# EAGLE design PNP (EAGLE 6.1)
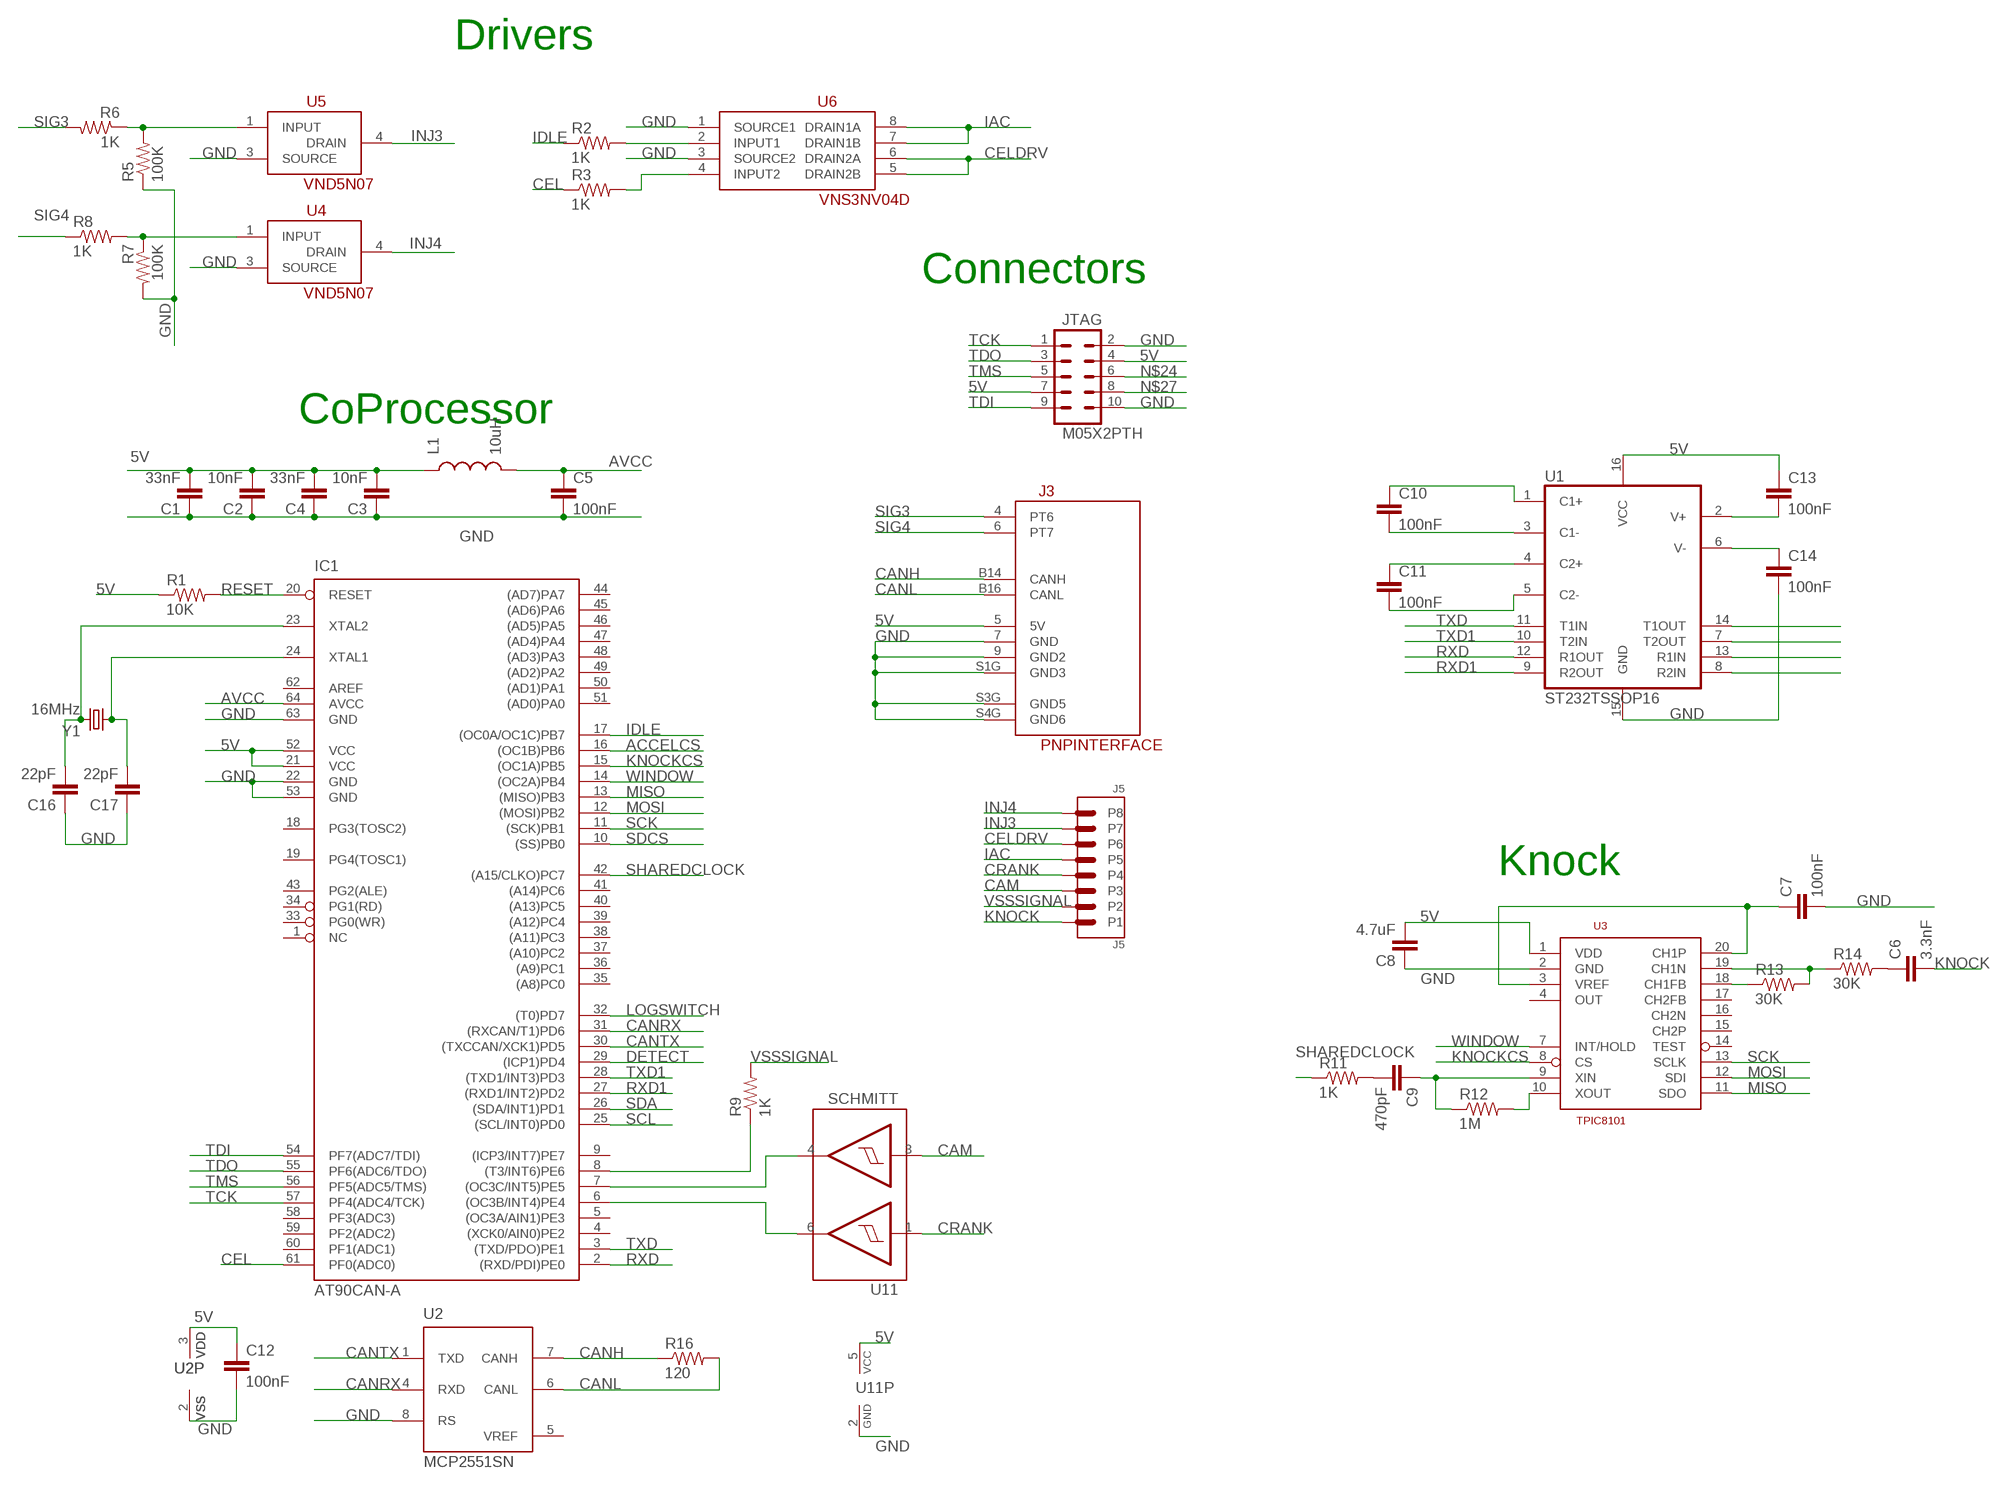
[diagram p0: schematic, sheet 1]

## Parts
C1  33nF  CAP0805  [0805]
C2  10nF  CAP0805  [0805]
C3  10nF  CAP0805  [0805]
C4  33nF  CAP0805  [0805]
C5  100nF  CAP0805  [0805]
C6  3.3nF  CAP0805  [0805]
C7  100nF  CAP0805  [0805]
C8  4.7uF  CAP0805  [0805]
C9  470pF  CAP0805  [0805]
C10  100nF  CAP0805  [0805]
C11  100nF  CAP0805  [0805]
C12  100nF  CAP0805  [0805]
C13  100nF  CAP0805  [0805]
C14  100nF  CAP0805  [0805]
C16  22pF  CAP0805  [0805]
C17  22pF  CAP0805  [0805]
IC1  AT90CAN-A  [TQFP64]
J3  PNPINTERFACE  [PNPBOARD]
J5  J5  TERMINAL8  [TERMINAL8]
JTAG  M05X2PTH  [AVR_ICSP]
L1  10uH  INDUCTOR1210  [1210]
R1  10K  RESISTOR0805-RES  [0805]
R2  1K  RESISTOR0805-RES  [0805]
R3  1K  RESISTOR0805-RES  [0805]
R5  100K  RESISTOR0805-RES  [0805]
R6  1K  RESISTOR0805-RES  [0805]
R7  100K  RESISTOR0805-RES  [0805]
R8  1K  RESISTOR0805-RES  [0805]
R9  1K  RESISTOR0805-RES  [0805]
R11  1K  RESISTOR0805-RES  [0805]
R12  1M  RESISTOR0805-RES  [0805]
R13  30K  RESISTOR0805-RES  [0805]
R14  30K  RESISTOR0805-RES  [0805]
R16  120  RESISTOR0805-RES  [0805]
U1  ST232TSSOP16  [TSSOP16]
U2  MCP2551SN  [SO8]
U3  TPIC8101  [SO-20DW]
U4  VND5N07  [DPAK]
U5  VND5N07  [DPAK]
U6  VNS3NV04D  [SO8]
U11  SCHMITT  SCHMITTTSOP  [TSOP6]
Y1  16MHz  CRYSTAL  [SM2-CRYSTAL-7ASERIES]

## Nets
5V: C1.2 C2.2 C3.2 C4.2 C8.2 C12.1 C13.1 IC1.21(VCC) IC1.52(VCC) J3.5(5V) JTAG.4 JTAG.7 L1.1 R1.1 U1.16(VCC) U2.3(VDD) U3.1(VDD) U11.5(VCC)
ACCELCS: IC1.16((OC1B)PB6)
AVCC: C5.1 IC1.64(AVCC) L1.2
CAM: J5.P3 U11.3(I2)
CANH: J3.B14(CANH) R16.1 U2.7(CANH)
CANL: J3.B16(CANL) R16.2 U2.6(CANL)
CANRX: IC1.31((RXCAN/T1)PD6) U2.4(RXD)
CANTX: IC1.30((TXCCAN/XCK1)PD5) U2.1(TXD)
CEL: IC1.61(PF0(ADC0)) R3.1
CELDRV: J5.P6 U6.5(DRAIN2B) U6.6(DRAIN2A)
CRANK: J5.P4 U11.1(I1)
DETECT: IC1.29((ICP1)PD4)
GND: C1.1 C2.1 C3.1 C4.1 C5.2 C7.2 C8.1 C12.2 C14.2 C16.1 C17.1 IC1.22(GND) IC1.53(GND) IC1.63(GND) J3.7(GND) J3.9(GND2) J3.S1G(GND3) J3.S3G(GND5) J3.S4G(GND6) JTAG.2 JTAG.10 R5.1 R7.2 U1.15(GND) U2.2(VSS) U2.8(RS) U3.2(GND) U4.3(SOURCE) U5.3(SOURCE) U6.1(SOURCE1) U6.3(SOURCE2) U11.2(GND)
IAC: J5.P5 U6.7(DRAIN1B) U6.8(DRAIN1A)
IDLE: IC1.17((OC0A/OC1C)PB7) R2.1
INJ3: J5.P7 U5.4(DRAIN)
INJ4: J5.P8 U4.4(DRAIN)
KNOCK: C6.2 J5.P1
KNOCKCS: IC1.15((OC1A)PB5) U3.8(CS)
LOGSWITCH: IC1.32((T0)PD7)
MISO: IC1.13((MISO)PB3) U3.11(SDO)
MOSI: IC1.12((MOSI)PB2) U3.12(SDI)
N$1: C6.1 R14.2
N$2: R5.2 R6.1 U5.1(INPUT)
N$3: IC1.7((OC3C/INT5)PE5) U11.4(O2)
N$4: IC1.6((OC3B/INT4)PE4) U11.6(O1)
N$5: R2.2 U6.2(INPUT1)
N$6: C9.2 R11.2
N$7: R3.2 U6.4(INPUT2)
N$8: R7.1 R8.2 U4.1(INPUT)
N$9: C10.1 U1.1(C1+)
N$10: C10.2 U1.3(C1-)
N$11: IC1.8((T3/INT6)PE6) R9.1
N$12: C9.1 R12.1 U3.9(XIN)
N$13: C11.1 U1.4(C2+)
N$14: R12.2 U3.10(XOUT)
N$15: C16.2 IC1.23(XTAL2) Y1.P$2
N$16: C17.2 IC1.24(XTAL1) Y1.P$1
N$17: C11.2 U1.5(C2-)
N$18: C7.1 U3.3(VREF) U3.20(CH1P)
N$19: U1.7(T2OUT)
N$20: C13.2 U1.2(V+)
N$21: C14.1 U1.6(V-)
N$22: R13.2 R14.1 U3.19(CH1N)
N$23: R13.1 U3.18(CH1FB)
N$24: JTAG.6
N$27: JTAG.8
N$30: U1.14(T1OUT)
N$31: U1.13(R1IN)
N$32: U1.8(R2IN)
RESET: IC1.20(RESET) R1.2
RXD: IC1.2((RXD/PDI)PE0) U1.12(R1OUT)
RXD1: IC1.27((RXD1/INT2)PD2) U1.9(R2OUT)
SCK: IC1.11((SCK)PB1) U3.13(SCLK)
SCL: IC1.25((SCL/INT0)PD0)
SDA: IC1.26((SDA/INT1)PD1)
SDCS: IC1.10((SS)PB0)
SHAREDCLOCK: IC1.42((A15/CLKO)PC7) R11.1
SIG3: J3.4(PT6) R6.2
SIG4: J3.6(PT7) R8.1
TCK: IC1.57(PF4(ADC4/TCK)) JTAG.1
TDI: IC1.54(PF7(ADC7/TDI)) JTAG.9
TDO: IC1.55(PF6(ADC6/TDO)) JTAG.3
TMS: IC1.56(PF5(ADC5/TMS)) JTAG.5
TXD: IC1.3((TXD/PDO)PE1) U1.11(T1IN)
TXD1: IC1.28((TXD1/INT3)PD3) U1.10(T2IN)
VSSSIGNAL: J5.P2 R9.2
WINDOW: IC1.14((OC2A)PB4) U3.7(INT/HOLD)
Unconnected: IC1.1(NC) IC1.4((XCK0/AIN0)PE2) IC1.5((OC3A/AIN1)PE3) IC1.9((ICP3/INT7)PE7) IC1.18(PG3(TOSC2)) IC1.19(PG4(TOSC1)) IC1.33(PG0(WR)) IC1.34(PG1(RD)) IC1.35((A8)PC0) IC1.36((A9)PC1) IC1.37((A10)PC2) IC1.38((A11)PC3) IC1.39((A12)PC4) IC1.40((A13)PC5) IC1.41((A14)PC6) IC1.43(PG2(ALE)) IC1.44((AD7)PA7) IC1.45((AD6)PA6) IC1.46((AD5)PA5) IC1.47((AD4)PA4) IC1.48((AD3)PA3) IC1.49((AD2)PA2) IC1.50((AD1)PA1) IC1.51((AD0)PA0) IC1.58(PF3(ADC3)) IC1.59(PF2(ADC2)) IC1.60(PF1(ADC1)) IC1.62(AREF) U2.5(VREF) U3.4(OUT) U3.14(TEST) U3.15(CH2P) U3.16(CH2N) U3.17(CH2FB)

## Notes on the sheet
- Drivers
- Connectors
- CoProcessor
- Knock

## Library data of the parts
C1-C14 C16 C17 = PNP:CAP: Capacitor Standard 0603 ceramic capacitor, and 0.1" leaded capacitor.
IC1 = PNP:AT90CAN: MICROCONTROLLER 32 Kbytes FLASH 2 Kbytes SRAM 1 Kbytes EEPROM CAN Controller 8-channel 10 bit ADC; DIGIKEY: AT90CAN32-16AU-ND; MPN: AT90CAN32-16AU
J3 = PNP:PNPINTERFACE: One use, interface to DIYPNP1.5 jumper locations
J5 = PNP:TERMINAL8: 8 terminal pluggable
JTAG = SparkFun:M05X2: Header 5x2 Standard 10-pin dual row 0.1" header. Commonly used with AVR-ISP. Use with Spark Fun Electronics SKU: PRT-00778
L1 = PNP:INDUCTOR: Inductors Basic Inductor/Choke - 0603 and 1206. Footprints are not proven and vary greatly between part numbers.
R1-R3 R5-R9 R11-R14 R16 = PNP:RESISTOR: Resistor Basic schematic elements and footprints for 0603, 1206, and PTH resistors.
U1 = PNP:ST232: RS232 Transceiver Very common IC. This is generically called 'MAX232', but works with the 3V equivalent MAX3232 generic ICs. Field tested and mother approved. Spark Fun Electronics SKU : COM-00316 (DIP) and COM-00589 (SMD)
U2 = PNP:MCP2551: High Speed CAN tranceiver
U3 = PNP:TPIC8101: Knock Detector Processing Chip, controllable over SPI; DIGIKEY: 296-24864-1-ND; MFN: TPIC8101DWRG4
U4 U5 = PNP:VND5N07: Single Power MOSFET of the OMNIFET family, 5A; DIGIKEY: 497-2481-5-ND; MFN: VND5N07
U6 = PNP:VNS3NV04D: Dual Protected MOSFET from OMNIFET family, 3A; DIGIKEY: 497-3318-1-ND; MFN: VNS3NV04D13TR
U11 = PNP:SCHMITT; DIGIKEY: 568-4618-1-ND; MFN: 74LVC2G17GV,125
Y1 = PNP:CRYSTAL: Crystals Various standard crystals. Proven footprints. Spark Fun Electronics SKU : COM-00534

## Net classes
0 default: width 0.203 mm, drill 0.254 mm, clearance 0.254 mm

## Board
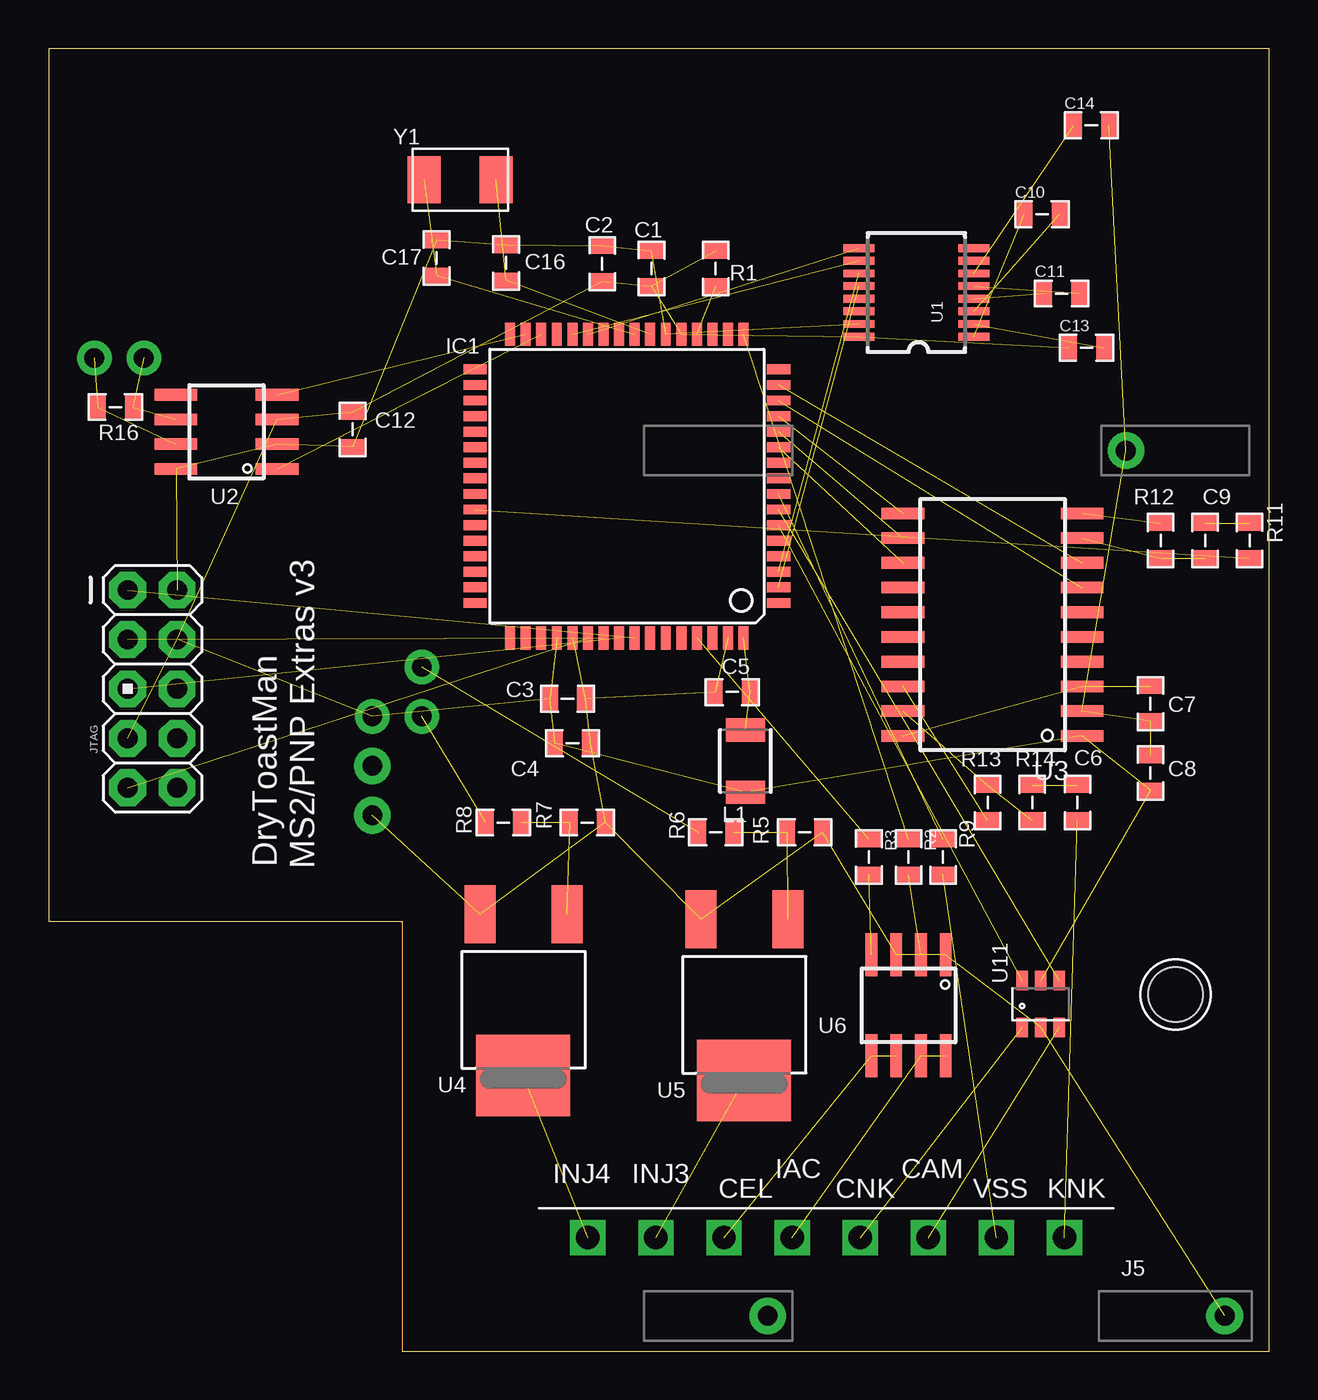
[diagram p1: board, top side]
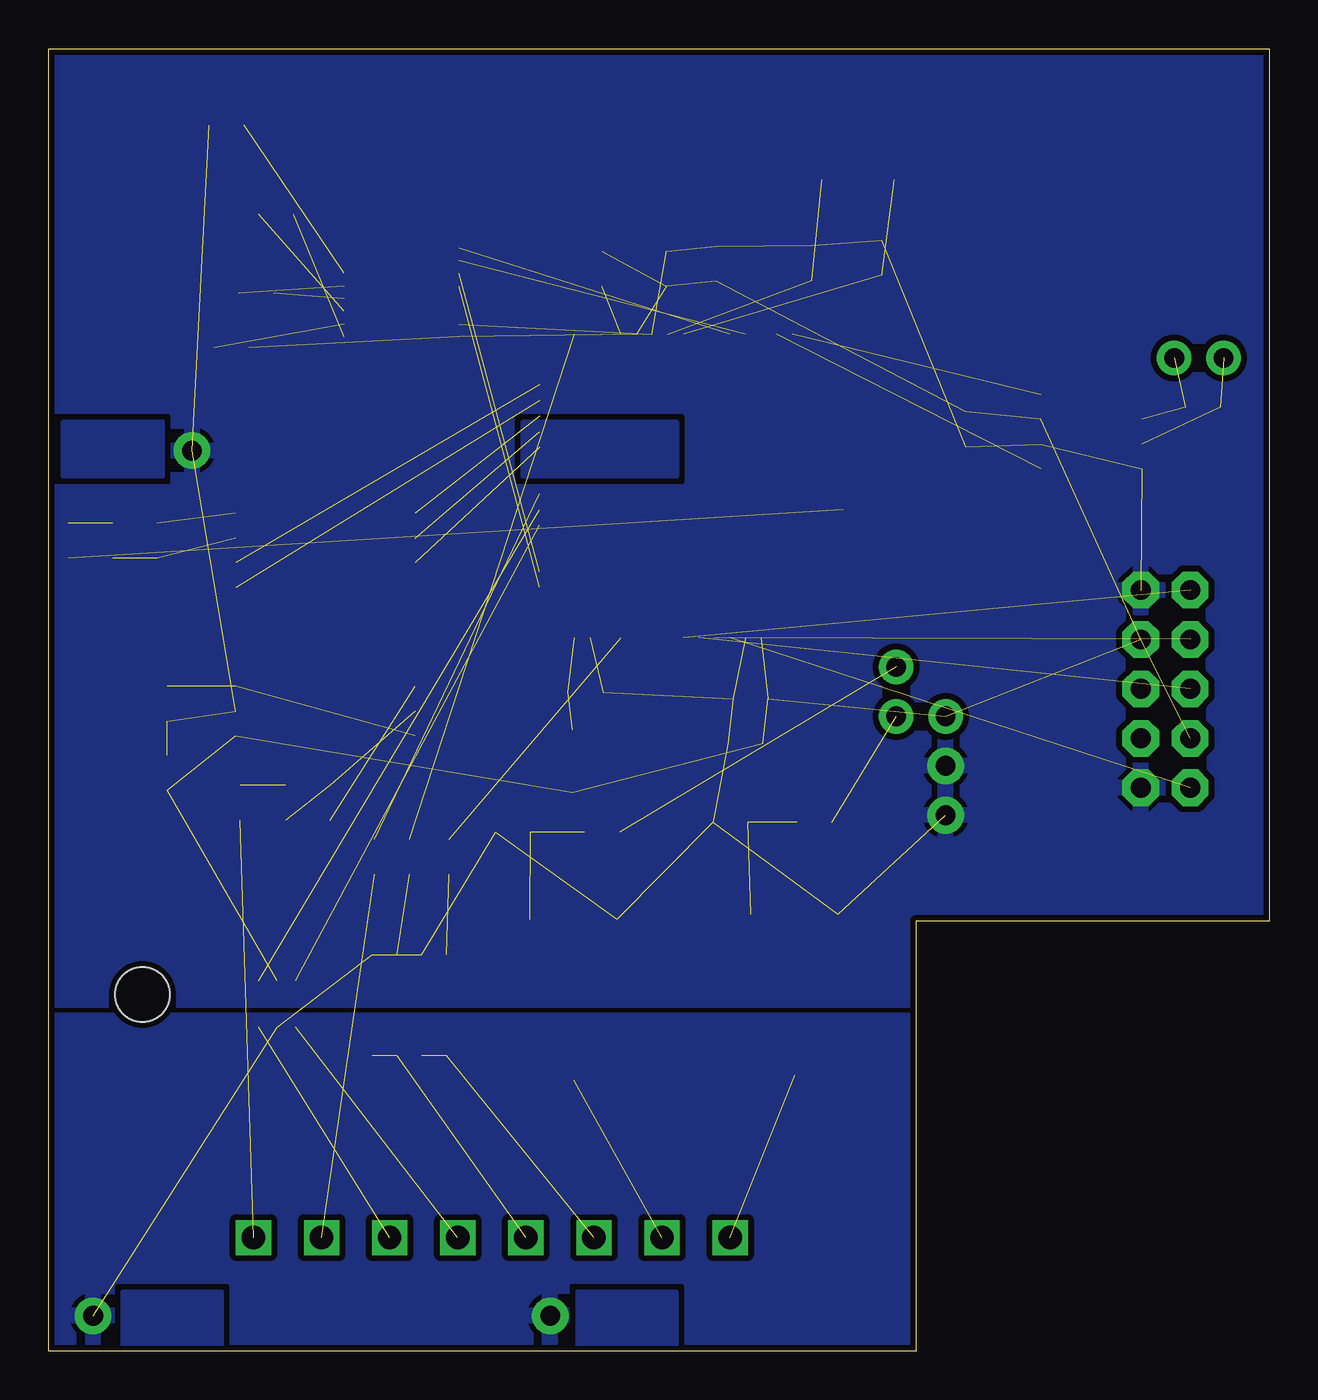
[diagram p2: board, bottom side, seen from below]

Size 62.74 x 66.93 mm. Coordinates in mm from the lower left corner, seen from the top.
Outline: 0,22.1 18.16,22.1 18.16,0 62.74,0 62.74,66.93 0,66.93 0,22.1
Copper layers (1*16): Top 0.035mm / dielectric 1.5mm / Bottom 0.035mm
Design rules: minimum track width 8mil, minimum drill 20mil, track to track 8mil, track to pad 8mil, pad to pad 8mil, via to via 8mil, smd to smd 8mil, copper to edge 10mil, drill to drill 8mil, minimum pad ring 12mil, minimum via ring 10mil, stop-mask expansion 4mil, vias tented up to drill 25mil, thermal gap 10mil

### Footprints (pad centres in the part's own frame; a part is rotated, then mirrored left to right if it is on the bottom)
0805 = smd 0.8 x 1.2: 1 -0.9,0; 2 0.9,0
TQFP64 = smd 1.194 x 0.508: 1 -7.8,6; 2 -7.8,5.2; 3 -7.8,4.4; 4 -7.8,3.6; 5 -7.8,2.8; 6 -7.8,2; 7 -7.8,1.2; 8 -7.8,0.4; 9 -7.8,-0.4; 10 -7.8,-1.2; 11 -7.8,-2; 12 -7.8,-2.8; 13 -7.8,-3.6; 14 -7.8,-4.4; 15 -7.8,-5.2; 16 -7.8,-6; 33 7.8,-6; 34 7.8,-5.2; 35 7.8,-4.4; 36 7.8,-3.6; 37 7.8,-2.8; 38 7.8,-2; 39 7.8,-1.2; 40 7.8,-0.4; 41 7.8,0.4; 42 7.8,1.2; 43 7.8,2; 44 7.8,2.8; 45 7.8,3.6; 46 7.8,4.4; 47 7.8,5.2; 48 7.8,6 | smd 0.508 x 1.194: 17 -6,-7.8; 18 -5.2,-7.8; 19 -4.4,-7.8; 20 -3.6,-7.8; 21 -2.8,-7.8; 22 -2,-7.8; 23 -1.2,-7.8; 24 -0.4,-7.8; 25 0.4,-7.8; 26 1.2,-7.8; 27 2,-7.8; 28 2.8,-7.8; 29 3.6,-7.8; 30 4.4,-7.8; 31 5.2,-7.8; 32 6,-7.8; 49 6,7.8; 50 5.2,7.8; 51 4.4,7.8; 52 3.6,7.8; 53 2.8,7.8; 54 2,7.8; 55 1.2,7.8; 56 0.4,7.8; 57 -0.4,7.8; 58 -1.2,7.8; 59 -2,7.8; 60 -2.8,7.8; 61 -3.6,7.8; 62 -4.4,7.8; 63 -5.2,7.8; 64 -6,7.8
PNPBOARD = drill 1.016 pad 1.778: 4 -15.24,16.828; 5 -17.78,14.287; 6 -15.24,14.287; B14 -32.068,32.703; B16 -29.527,32.703 | drill 1.016 pad 1.88: 7 -17.78,11.748; 9 -17.78,9.207; S1G 20.955,27.94; S3G 26.035,-16.51; S4G 2.54,-16.51 | hole 2.8: 23.495,0
TERMINAL8 = drill 1.2 square: P1 7,0; P2 3.5,0; P3 0,0; P4 -3.5,0; P5 -7,0; P6 -10.5,0; P7 -14,0; P8 -17.5,0
AVR_ICSP = drill 1.016 pad 1.88 octagon: 1 -1.27,5.08; 2 1.27,5.08; 3 -1.27,2.54; 4 1.27,2.54; 5 -1.27,0; 6 1.27,0; 7 -1.27,-2.54; 8 1.27,-2.54; 9 -1.27,-5.08; 10 1.27,-5.08
1210 = smd 1.2 x 2: 1 -1.6,0; 2 1.6,0
TSSOP16 = smd 0.4 x 1.6: 1 -2.225,-2.85; 2 -1.575,-2.85; 3 -0.925,-2.85; 4 -0.275,-2.85; 5 0.375,-2.85; 6 1.025,-2.85; 7 1.675,-2.85; 8 2.325,-2.85; 9 2.325,3.05; 10 1.675,3.05; 11 1.025,3.05; 12 0.375,3.05; 13 -0.275,3.05; 14 -0.925,3.05; 15 -1.575,3.05; 16 -2.225,3.05
SO8 = smd 0.6 x 2.2: 1 -1.905,-2.6; 2 -0.635,-2.6; 3 0.635,-2.6; 4 1.905,-2.6; 5 1.905,2.6; 6 0.635,2.6; 7 -0.635,2.6; 8 -1.905,2.6
SO-20DW = smd 0.6 x 2.2: 1 -5.715,-4.6; 2 -4.445,-4.6; 3 -3.175,-4.6; 4 -1.905,-4.6; 5 -0.635,-4.6; 6 0.635,-4.6; 7 1.905,-4.6; 8 3.175,-4.6; 9 4.445,-4.6; 10 5.715,-4.6; 11 5.715,4.6; 12 4.445,4.6; 13 3.175,4.6; 14 1.905,4.6; 15 0.635,4.6; 16 -0.635,4.6; 17 -1.905,4.6; 18 -3.175,4.6; 19 -4.445,4.6; 20 -5.715,4.6
DPAK = smd 1.6 x 2.997: 1 -2.261,-4.928; 3 2.21,-4.928 | smd 4.826 x 4.191: 4 0,3.353
TSOP6 = smd 0.6 x 1: 1 0,-2.4; 2 0.95,-2.4; 3 1.9,-2.4; 4 1.9,0; 5 0.95,0; 6 0,0
SM2-CRYSTAL-7ASERIES = smd 1.7 x 2.4: P$1 0,0; P$2 3.7,0

### Placement (x,y rotation side)
C1  30.99,55.63 270 top
C2  28.45,55.88 270 top
C3  26.67,33.53 180 top
C4  26.92,31.24 180 top
C5  35.14,33.87 180 top
C6  52.88,28.19 270 top
C7  56.64,33.27 270 top
C8  56.64,29.72 270 top
C9  59.44,41.66 90 top
C10  51.05,58.42 0 top
C11  52.07,54.36 0 top
C12  15.62,47.37 270 top
C13  53.34,51.56 0 top
C14  53.59,62.99 0 top
C16  23.51,55.92 270 top
C17  19.94,56.18 270 top
IC1  29.72,44.45 180 top
J3  34.42,18.34 0 top
J5  45.21,5.84 0 top
JTAG  5.33,34.04 0 top
L1  35.81,30.33 90 top
R1  34.29,55.63 270 top
R2  44.2,25.4 270 top
R3  42.16,25.4 270 top
R5  38.86,26.67 180 top
R6  34.29,26.67 180 top
R7  27.69,27.18 0 top
R8  23.37,27.18 0 top
R9  45.97,25.4 270 top
R11  61.72,41.66 90 top
R12  57.15,41.66 90 top
R13  48.26,28.19 90 top
R14  50.55,28.19 90 top
R16  3.43,48.51 0 top
U1  44.7,54.36 90 top
U2  9.14,47.24 90 top
U3  48.51,37.34 90 top
U4  24.38,17.53 180 top
U5  35.73,17.27 180 top
U6  44.2,17.78 180 top
U11  50.04,19.05 0 top
Y1  19.3,60.2 0 top

### Tracks (layer width: path | path; a pad name or v marks a point on that pad's centre or on a via)
5V  (17 unrouted)
AVCC  (2 unrouted)
CAM  (1 unrouted)
CANH  (2 unrouted)
CANL  (2 unrouted)
CANRX  (1 unrouted)
CANTX  (1 unrouted)
CEL  (1 unrouted)
CELDRV  (2 unrouted)
CRANK  (1 unrouted)
GND  (26 unrouted)
  pour Bottom (isolate 0.305, rank 2): 0.51,22.61 18.54,22.61 18.54,18.03 62.23,18.03 62.23,66.55 0.51,66.55
  pour Bottom (isolate 0.305, rank 2): 18.54,0.51 62.23,0.51 62.23,17.02 18.54,17.02
IAC  (2 unrouted)
IDLE  (1 unrouted)
INJ3  (1 unrouted)
INJ4  (1 unrouted)
KNOCK  (1 unrouted)
KNOCKCS  (1 unrouted)
MISO  (1 unrouted)
MOSI  (1 unrouted)
N$1  (1 unrouted)
N$2  (2 unrouted)
N$3  (1 unrouted)
N$4  (1 unrouted)
N$5  (1 unrouted)
N$6  (1 unrouted)
N$7  (1 unrouted)
N$8  (2 unrouted)
N$9  (1 unrouted)
N$10  (1 unrouted)
N$11  (1 unrouted)
N$12  (2 unrouted)
N$13  (1 unrouted)
N$14  (1 unrouted)
N$15  (2 unrouted)
N$16  (2 unrouted)
N$17  (1 unrouted)
N$18  (2 unrouted)
N$20  (1 unrouted)
N$21  (1 unrouted)
N$22  (2 unrouted)
N$23  (1 unrouted)
N$25
  pour Bottom (isolate 0.254): 30.48,3.05 35.56,3.05 35.56,0.25 30.48,0.25
N$26
  pour Bottom (isolate 0.254): 53.85,3.05 58.93,3.05 58.93,0.25 53.85,0.25
N$28
  pour Bottom (isolate 0.254): 38.35,44.96 38.35,47.75 30.48,47.75 30.48,44.96
N$29
  pour Bottom (isolate 0.254): 56.9,47.75 56.9,44.96 61.98,44.96 61.98,47.75
RESET  (1 unrouted)
RXD  (1 unrouted)
RXD1  (1 unrouted)
SCK  (1 unrouted)
SHAREDCLOCK  (1 unrouted)
SIG3  (1 unrouted)
SIG4  (1 unrouted)
TCK  (1 unrouted)
TDI  (1 unrouted)
TDO  (1 unrouted)
TMS  (1 unrouted)
TXD  (1 unrouted)
TXD1  (1 unrouted)
VSSSIGNAL  (1 unrouted)
WINDOW  (1 unrouted)

### Text on the board
tNames: DryToastMan | MS2/PNP Extras v3 | INJ4 | INJ3 | IAC | CAM | CEL | CNK | VSS | KNK